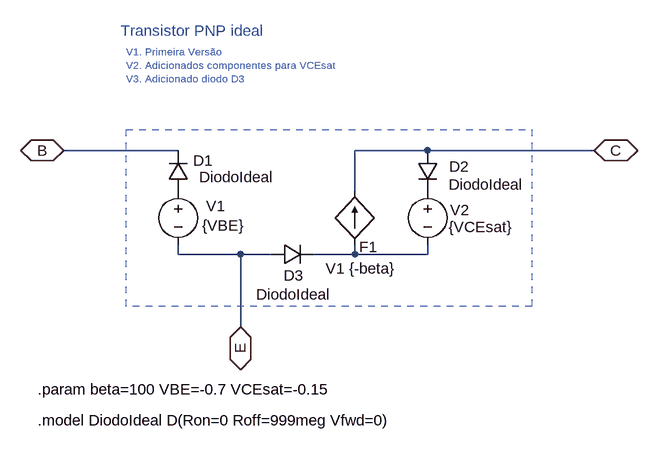
[diagram p0: schematic BJT_PNP_ideal.asc]
BJT_PNP_ideal.asc, the LTspice schematic file:
Version 4
SHEET 1 1008 728
WIRE 176 -448 0 -448
WIRE 560 -448 448 -448
WIRE 816 -448 560 -448
WIRE 448 -384 448 -448
WIRE 176 -288 176 -304
WIRE 272 -288 176 -288
WIRE 320 -288 272 -288
WIRE 448 -288 448 -304
WIRE 448 -288 384 -288
WIRE 560 -288 560 -304
WIRE 560 -288 448 -288
WIRE 272 -176 272 -288
FLAG 0 -448 B
IOPIN 0 -448 BiDir
FLAG 272 -176 E
IOPIN 272 -176 BiDir
FLAG 816 -448 C
IOPIN 816 -448 BiDir
SYMBOL voltage 176 -400 R0
WINDOW 123 0 0 Left 0
WINDOW 39 0 0 Left 0
WINDOW 3 37 68 Left 2
WINDOW 0 43 38 Left 2
SYMATTR Value {VBE}
SYMATTR InstName V1
SYMBOL f 448 -304 R180
WINDOW 3 -63 -38 Left 2
WINDOW 0 -35 -5 Left 2
SYMATTR Value V1 {-beta}
SYMATTR InstName F1
SYMBOL diode 192 -384 R180
WINDOW 0 -38 48 Left 2
WINDOW 3 -132 23 Left 2
SYMATTR InstName D1
SYMATTR Value DiodoIdeal
SYMBOL voltage 560 -400 R0
WINDOW 123 0 0 Left 0
WINDOW 39 0 0 Left 0
WINDOW 3 32 70 Left 2
WINDOW 0 35 44 Left 2
SYMATTR Value {VCEsat}
SYMATTR InstName V2
SYMBOL diode 544 -448 R0
WINDOW 0 49 25 Left 2
WINDOW 3 48 53 Left 2
SYMATTR InstName D2
SYMATTR Value DiodoIdeal
SYMBOL diode 320 -272 R270
WINDOW 0 -32 34 VTop 2
WINDOW 3 -30 34 VBottom 2
SYMATTR InstName D3
SYMATTR Value DiodoIdeal
TEXT -40 -80 Left 2 !.param beta=100 VBE=-0.7 VCEsat=-0.15
TEXT -40 -32 Left 2 !.model DiodoIdeal D(Ron=0 Roff=999meg Vfwd=0)
TEXT 88 -632 Left 2 ;Transistor PNP ideal
TEXT 96 -600 Left 1 ;V1. Primeira Versão\nV2. Adicionados componentes para VCEsat\nV3. Adicionado diodo D3
RECTANGLE Normal 720 -208 96 -480 2

The netlist it stands for:
* BJT_PNP_ideal.asc
V1 P001 E {VBE}
F1 N001 C V1 {-beta}
D1 P001 B DiodoIdeal
V2 P002 N001 {VCEsat}
D2 C P002 DiodoIdeal
D3 E N001 DiodoIdeal
.model D D
.lib standard.dio
.param beta=100 VBE=-0.7 VCEsat=-0.15
.model DiodoIdeal D(Ron=0 Roff=999meg Vfwd=0)
* Transistor PNP ideal
* V1. Primeira Versão
* V2. Adicionados componentes para VCEsat
* V3. Adicionado diodo D3
.backanno
.end